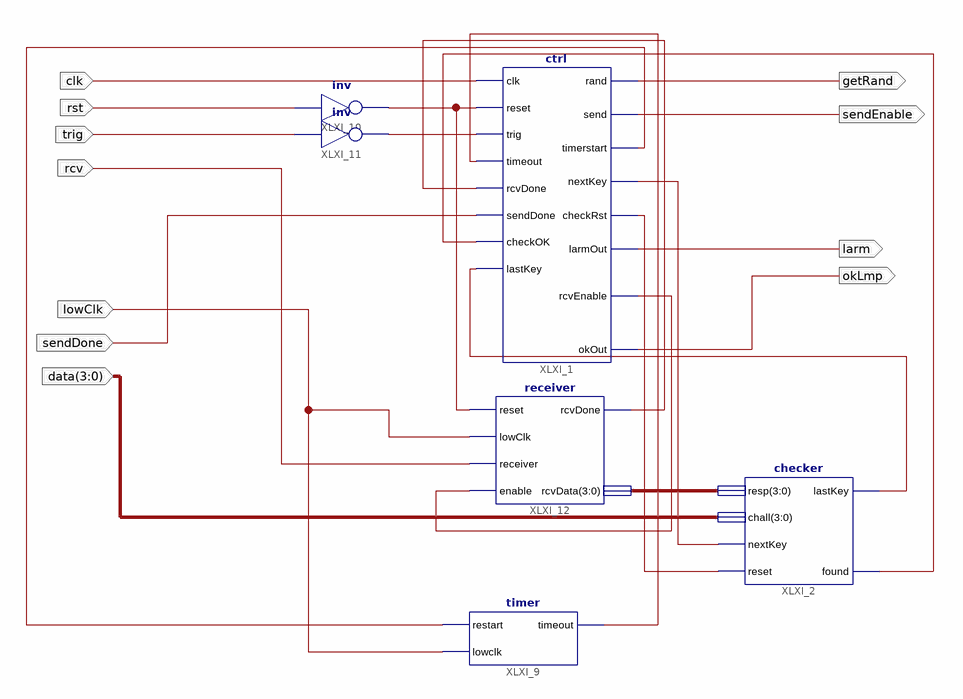
[diagram p0: schematic sheet 1]
// Xilinx ISE schematic top.sch (xc9500xl) as structural Verilog: 6 symbols, 11 ports
module top (
  input  sendDone,
  input  [3:0] data,
  input  clk,
  input  rst,
  input  trig,
  input  lowClk,
  input  rcv,
  output getRand,
  output sendEnable,
  output larm,
  output okLmp
);

  wire Timeout, XLXN_4, XLXN_5, XLXN_30, XLXN_51, XLXN_56, XLXN_61, XLXN_84, XLXN_85, XLXN_105;
  wire [3:0] XLXN_83;

  ctrl XLXI_1 (
    .clk(clk), .reset(XLXN_51), .trig(XLXN_56), .timeout(Timeout), .rcvDone(XLXN_84), .sendDone(sendDone),
    .checkOK(XLXN_105), .lastKey(XLXN_61), .\rand (getRand), .send(sendEnable), .rcvEnable(XLXN_85),
    .timerstart(XLXN_30), .nextKey(XLXN_4), .checkRst(XLXN_5), .larmOut(larm), .okOut(okLmp));
  not XLXI_10 (XLXN_51, rst);
  not XLXI_11 (XLXN_56, trig);
  \checker  XLXI_2 (
    .resp(XLXN_83), .chall(data), .nextKey(XLXN_4), .reset(XLXN_5), .lastKey(XLXN_61), .found(XLXN_105));
  timer XLXI_9 (.restart(XLXN_30), .lowclk(lowClk), .timeout(Timeout));
  receiver XLXI_12 (
    .reset(XLXN_51), .lowClk(lowClk), .receiver(rcv), .enable(XLXN_85), .rcvDone(XLXN_84), .rcvData(XLXN_83));
endmodule
